# Altium schematic sheet Sensores.SchDoc
size A4
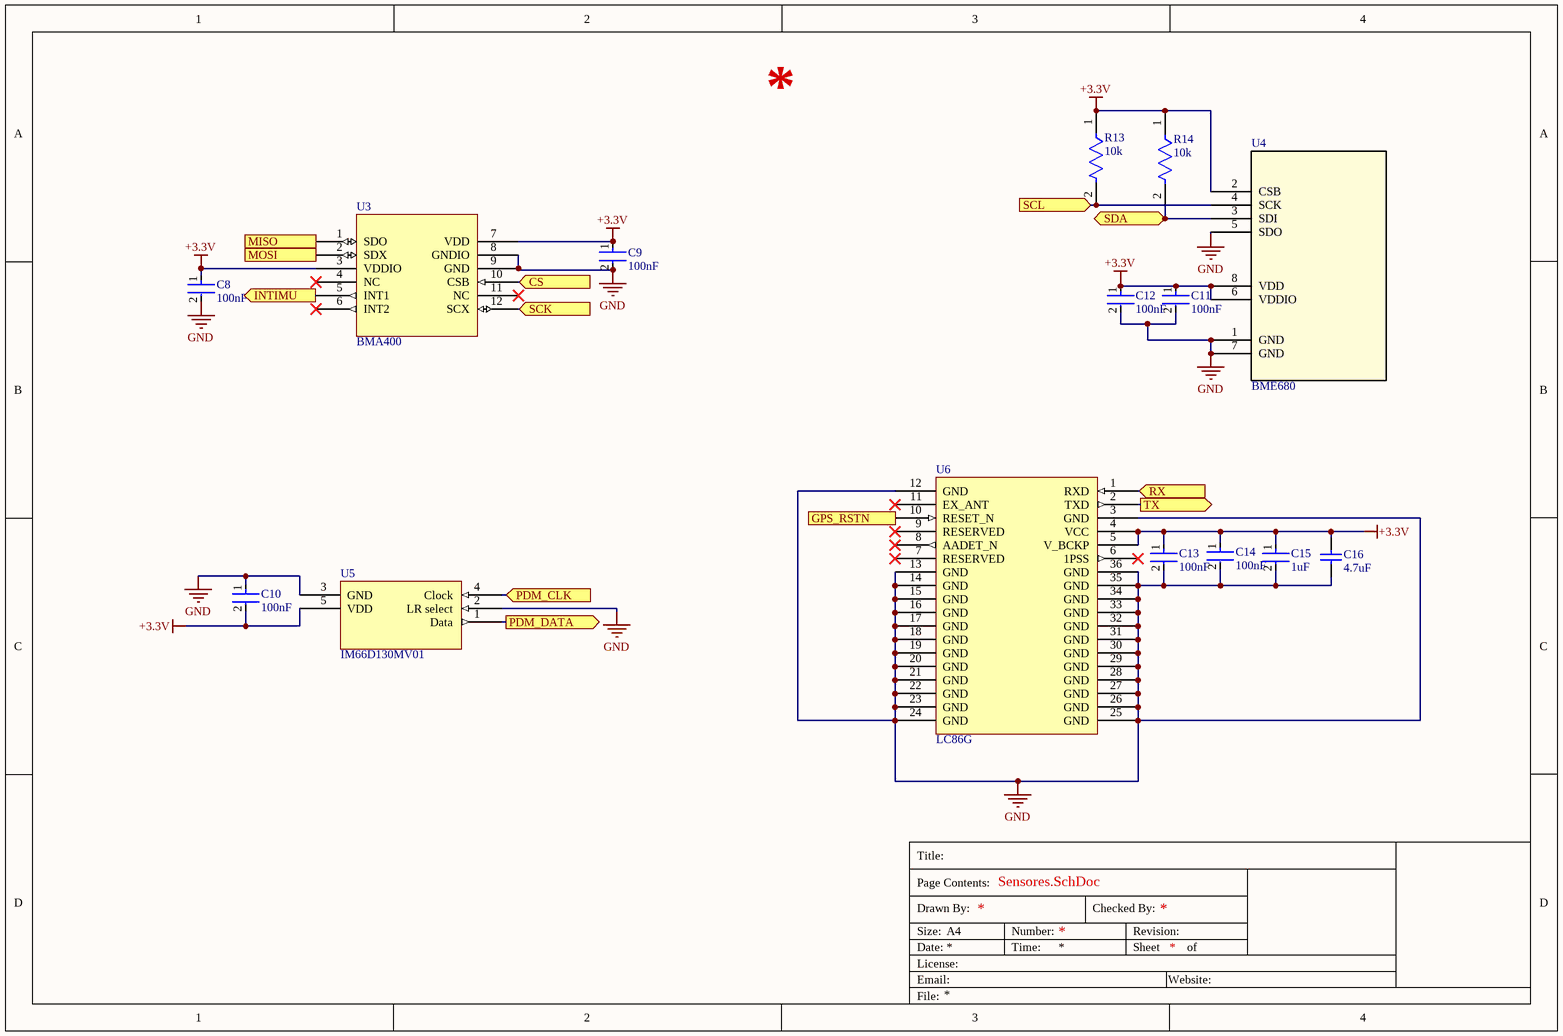
[diagram p0: Sensores.SchDoc]

## Parts
C8  100nF  [FP-GCG188-0_2-IPC_B]
C9  100nF  [FP-GCG188-0_2-IPC_B]
C10  100nF  [FP-GCG188-0_2-IPC_B]
C11  100nF  [FP-GCG188-0_2-IPC_B]
C12  100nF  [FP-GCG188-0_2-IPC_B]
C13  100nF  [FP-GCG188-0_2-IPC_B]
C14  100nF  [FP-GCG188-0_2-IPC_B]
C15  1uF  [FP-CL10-IPC_C]
C16  4.7uF  [CAPC2014X150X70ML20]
R13  10k  [FP-CRCW0603-HPe3-MFG]
R14  10k  [FP-CRCW0603-HPe3-MFG]
U3  BMA400  [LGA-12]
U4  BME680  [LGA8_BME680_BOS]
U5  IM66D130MV01  [IFX-PG-TLGA-5-8]
U6  LC86G  [LD86G]

## Ports
CS (in), GPS_RSTN (in), INTIMU (out), MISO (out), MOSI (in), PDM_CLK (in), PDM_DATA (out), RX (in), SCK (in), SCL (in), SDA (bidir), TX (out)

## Nets
+3.3V: C8.1 C9.1 C10.2 C11.1 C12.1 C13.1 C14.1 C15.1 C16.2 R13.1 R14.1 U3.3(VDDIO) U3.7(VDD) U4.2(CSB) U4.6(VDDIO) U4.8(VDD) U5.5(VDD) U6.4(VCC) U6.5(V_BCKP)
GND: C8.2 C9.2 C10.1 C11.2 C12.2 C13.2 C14.2 C15.2 C16.1 U3.8(GNDIO) U3.9(GND) U4.1(GND) U4.5(SDO) U4.7(GND) U5.2(LR_select) U5.3(GND) U6.3(GND) U6.12(GND) U6.13(GND) U6.14(GND) U6.15(GND) U6.16(GND) U6.17(GND) U6.18(GND) U6.19(GND) U6.20(GND) U6.21(GND) U6.22(GND) U6.23(GND) U6.24(GND) U6.25(GND) U6.26(GND) U6.27(GND) U6.28(GND) U6.29(GND) U6.30(GND) U6.31(GND) U6.32(GND) U6.33(GND) U6.34(GND) U6.35(GND) U6.36(GND)
CS: U3.10(CSB) ; port CS
GPS_RSTN: U6.10(RESET_N) ; port GPS_RSTN
INTIMU: U3.5(INT1) ; port INTIMU
MISO: U3.1(SDO) ; port MISO
MOSI: U3.2(SDX) ; port MOSI
PDM_CLK: U5.4(Clock) ; port PDM_CLK
PDM_DATA: U5.1(Data) ; port PDM_DATA
RX: U6.1(RXD) ; port RX
SCK: U3.12(SCX) ; port SCK
SCL: R13.2 U4.4(SCK) ; port SCL
SDA: R14.2 U4.3(SDI) ; port SDA
TX: U6.2(TXD) ; port TX

Not connected (* = marked no-connect by the designer): U3 4(NC)* 6(INT2)* 11(NC)*; U6 6(1PSS)* 7(RESERVED)* 8(AADET_N)* 9(RESERVED)* 11(EX_ANT)*

## Notes on the sheet
- Title:
- Drawn By:
- Page Contents:
- Checked By:
- Size:
- Date:
- File:
- License:
- Email:
- A4
- Number:
- Time:
- Revision:
- Sheet
- Website:
- of

## Library data of the parts
C8-C14 = CMP-06035-011350-1: AgPd Termination Conductive Glue Mounting Chip Multilayer Ceramic Capacitors for Automotive 0.1uF with 20% as tolerance, 50V X8R 15%, 0603 Package
C15 = CMP-13271-002188-1: Cap Ceramic 1uF 16V X7R ±10% Pad SMD 0603 +125°C T/R; Width: 0.031inch; Max Operating Temperature: 125°C; Case/Package: 0603; Features: Soft Termination; Mount: Surface Mount; Min Operating Temperature: -55°C; Packaging: Tape and Reel; Dielectric: X7R; Voltage Rating: 16V; Capacitance: 1uF; Thickness: 0.035inch; Length: 0.063inch; Depth: 0.8mm; Lead Free: Lead Free; Tolerance: 10%; Ratings: AEC-Q200; Case Code (Imperial): 0603; Case Code (Metric): 1608
C16 = CMP-2007-00037-1: Part Number: TACR475M010RTA; Manufacturer: AVX Interconnect / Elco
R13 R14 = CMP-2000-03835-2: RES SMD 10K OHM 1% 1/3W 0603; Resistance: 10kR; Voltage Rating (DC): 75V; Max Power Dissipation: 250mW; Temperature Coefficient: 100ppm/°C; Case Code (Metric): 1608; Features: Automotive AEC-Q200; Termination: SMD/SMT; Number of Terminations: 2; Case Code (Imperial): 0603; Tolerance: 1%; Depth: 0.85mm; Package Quantity: 10; Length: 1.6mm; Packaging: Tape and Reel; Contact Plating: Tin; Radiation Hardening: No; Case/Package: 0603; Composition: Thick Film; Voltage Rating: 75V; Weight: 7.1E-05oz; Max Operating Temperature: 155°C; Lead Free: Lead Free; Width: 0.033inch; Power Rating: 250mW; Min Operating Temperature: -55°C; Military Standard: Not; Height: 0.45mm
U4 = BME680: Description; Manufacturer_Name: Bosch Sensortec; Copyright: Copyright (C) 2025 Ultra Librarian. All rights reserved.; Manufacturer_Part_Number: BME680; RefDes: RefDes; Type: Type